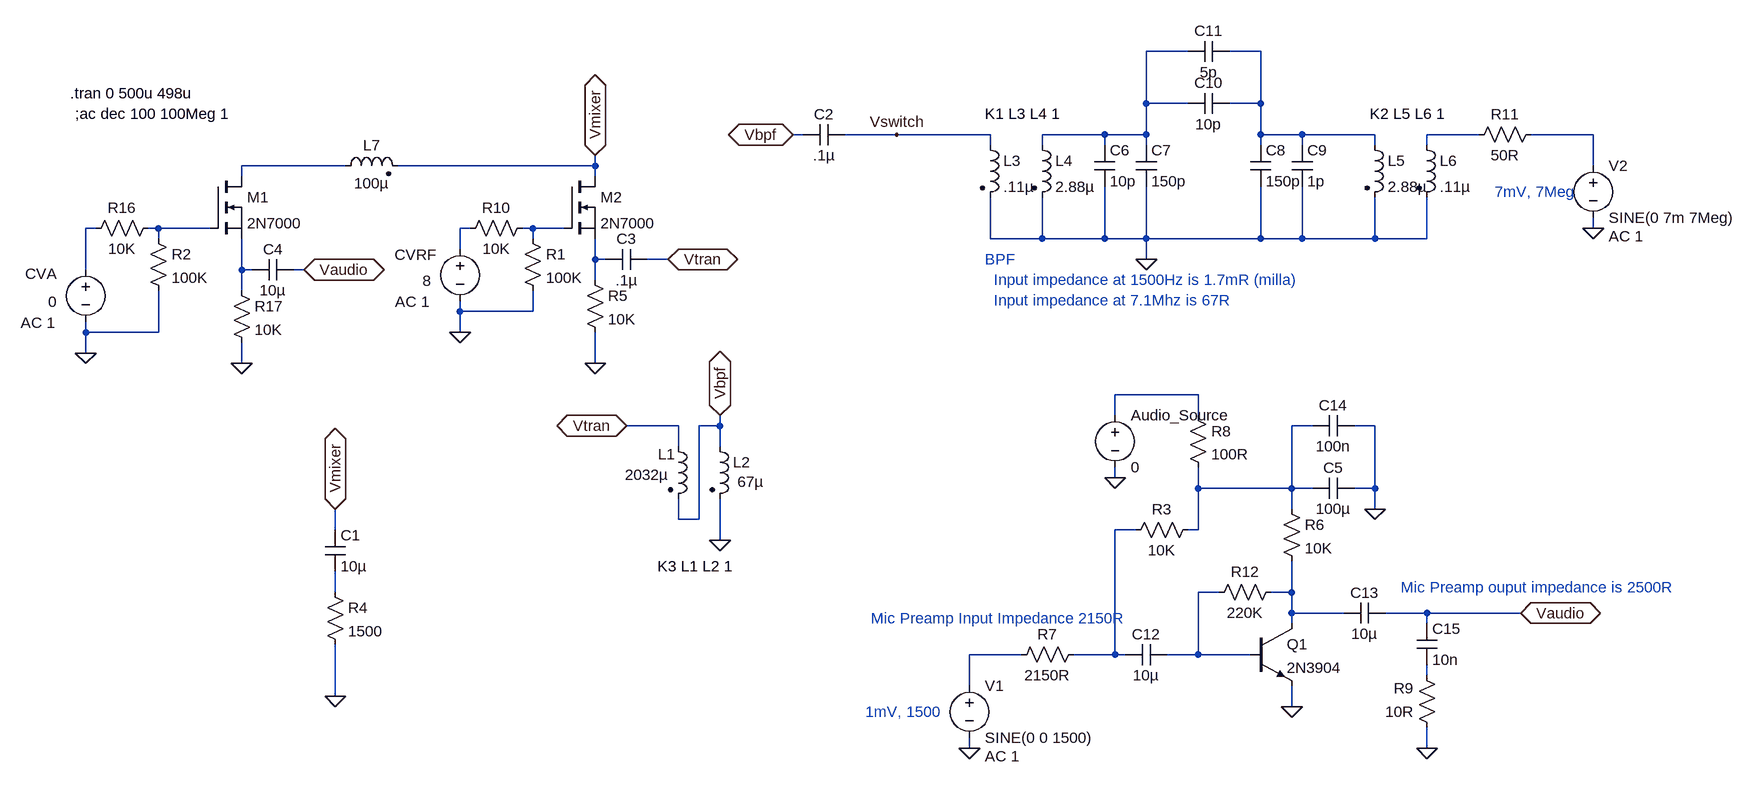
[diagram p0: schematic Receive Chain FET Switch Test.asc]
Receive Chain FET Switch Test.asc, the LTspice schematic file:
Version 4
SHEET 1 2548 2196
WIRE 816 80 752 80
WIRE 928 80 880 80
WIRE 752 160 752 80
WIRE 816 160 752 160
WIRE 928 160 928 80
WIRE 928 160 880 160
WIRE 224 208 208 208
WIRE 368 208 288 208
WIRE 512 208 368 208
WIRE 688 208 592 208
WIRE 752 208 752 160
WIRE 752 208 688 208
WIRE 928 208 928 160
WIRE 992 208 928 208
WIRE 1104 208 992 208
WIRE 1264 208 1184 208
WIRE 1440 208 1344 208
WIRE 512 224 512 208
WIRE 592 224 592 208
WIRE 688 224 688 208
WIRE 752 224 752 208
WIRE 928 224 928 208
WIRE 992 224 992 208
WIRE 1104 224 1104 208
WIRE 1184 224 1184 208
WIRE -480 256 -640 256
WIRE -96 256 -96 240
WIRE -96 256 -400 256
WIRE 1440 256 1440 208
WIRE -640 272 -640 256
WIRE -96 272 -96 256
WIRE -864 352 -880 352
WIRE -768 352 -784 352
WIRE -688 352 -768 352
WIRE -288 352 -304 352
WIRE -192 352 -208 352
WIRE -144 352 -192 352
WIRE 1440 352 1440 336
WIRE -768 368 -768 352
WIRE -192 368 -192 352
WIRE 512 368 512 304
WIRE 592 368 592 304
WIRE 592 368 512 368
WIRE 688 368 688 288
WIRE 688 368 592 368
WIRE 752 368 752 288
WIRE 752 368 688 368
WIRE 928 368 928 288
WIRE 928 368 752 368
WIRE 992 368 992 288
WIRE 992 368 928 368
WIRE 1104 368 1104 304
WIRE 1104 368 992 368
WIRE 1184 368 1184 304
WIRE 1184 368 1104 368
WIRE -304 384 -304 352
WIRE -96 400 -96 368
WIRE -80 400 -96 400
WIRE 16 400 -16 400
WIRE 752 400 752 368
WIRE -880 416 -880 352
WIRE -640 416 -640 368
WIRE -624 416 -640 416
WIRE -544 416 -560 416
WIRE -96 432 -96 400
WIRE -640 448 -640 416
WIRE -304 480 -304 464
WIRE -192 480 -192 448
WIRE -192 480 -304 480
WIRE -880 512 -880 496
WIRE -768 512 -768 448
WIRE -768 512 -880 512
WIRE -304 512 -304 480
WIRE -880 544 -880 512
WIRE -640 560 -640 528
WIRE -96 560 -96 512
WIRE 832 608 704 608
WIRE 704 640 704 608
WIRE 832 640 832 608
WIRE 32 656 -48 656
WIRE 96 656 96 640
WIRE 96 656 64 656
WIRE 1008 656 976 656
WIRE 1104 656 1072 656
WIRE 32 688 32 656
WIRE 96 688 96 656
WIRE 704 736 704 720
WIRE 832 752 832 720
WIRE 976 752 976 656
WIRE 976 752 832 752
WIRE 1008 752 976 752
WIRE 1104 752 1104 656
WIRE 1104 752 1072 752
WIRE 976 784 976 752
WIRE 1104 784 1104 752
WIRE 32 800 32 768
WIRE 64 800 64 656
WIRE 64 800 32 800
WIRE -496 816 -496 784
WIRE 736 816 704 816
WIRE 832 816 832 752
WIRE 832 816 816 816
WIRE 96 832 96 768
WIRE -496 912 -496 880
WIRE 864 912 832 912
WIRE 976 912 976 864
WIRE 976 912 944 912
WIRE 976 944 976 912
WIRE 1056 944 976 944
WIRE 1184 944 1120 944
WIRE 1328 944 1184 944
WIRE 976 960 976 944
WIRE 1184 960 1184 944
WIRE 560 1008 480 1008
WIRE 704 1008 704 816
WIRE 704 1008 640 1008
WIRE 720 1008 704 1008
WIRE 832 1008 832 912
WIRE 832 1008 784 1008
WIRE 912 1008 832 1008
WIRE 1184 1040 1184 1024
WIRE 480 1056 480 1008
WIRE -496 1072 -496 992
WIRE 976 1088 976 1056
WIRE 480 1152 480 1136
WIRE 1184 1152 1184 1120
FLAG -880 544 0
FLAG 96 640 Vbpf
IOPIN 96 640 BiDir
FLAG 752 400 0
FLAG -496 1072 0
FLAG 368 208 Vswitch
FLAG 208 208 Vbpf
IOPIN 208 208 BiDir
FLAG 1328 944 Vaudio
IOPIN 1328 944 BiDir
FLAG 96 832 0
FLAG -544 416 Vaudio
IOPIN -544 416 BiDir
FLAG -496 784 Vmixer
IOPIN -496 784 BiDir
FLAG -96 240 Vmixer
IOPIN -96 240 BiDir
FLAG -48 656 Vtran
IOPIN -48 656 BiDir
FLAG 16 400 Vtran
IOPIN 16 400 BiDir
FLAG -304 512 0
FLAG -96 560 0
FLAG -640 560 0
FLAG 704 736 0
FLAG 480 1152 0
FLAG 976 1088 0
FLAG 1104 784 0
FLAG 1184 1152 0
FLAG 1440 352 0
SYMBOL voltage -880 400 R0
WINDOW 123 -100 97 Left 2
WINDOW 39 0 0 Left 2
WINDOW 0 -93 22 Left 2
WINDOW 3 -58 65 Left 2
SYMATTR Value2 AC 1
SYMATTR InstName CVA
SYMATTR Value 0
SYMBOL cap 288 192 R90
WINDOW 0 0 32 VBottom 2
WINDOW 3 32 32 VTop 2
SYMATTR InstName C2
SYMATTR Value .1µ
SYMBOL cap 672 224 R0
SYMATTR InstName C6
SYMATTR Value 10p
SYMBOL cap 736 224 R0
SYMATTR InstName C7
SYMATTR Value 150p
SYMBOL cap 912 224 R0
SYMATTR InstName C8
SYMATTR Value 150p
SYMBOL cap 976 224 R0
SYMATTR InstName C9
SYMATTR Value 1p
SYMBOL cap 880 144 R90
WINDOW 0 0 32 VBottom 2
WINDOW 3 32 32 VTop 2
SYMATTR InstName C10
SYMATTR Value 10p
SYMBOL cap 880 64 R90
WINDOW 0 0 32 VBottom 2
WINDOW 3 32 32 VTop 2
SYMATTR InstName C11
SYMATTR Value 5p
SYMBOL ind2 496 208 R0
SYMATTR InstName L3
SYMATTR Value .11µ
SYMATTR Type ind
SYMBOL ind2 576 208 R0
SYMATTR InstName L4
SYMATTR Value 2.88µ
SYMATTR Type ind
SYMBOL ind2 1088 208 R0
SYMATTR InstName L5
SYMATTR Value 2.88µ
SYMATTR Type ind
SYMBOL ind2 1168 208 R0
SYMATTR InstName L6
SYMATTR Value .11µ
SYMATTR Type ind
SYMBOL res -512 896 R0
SYMATTR InstName R4
SYMATTR Value 1500
SYMBOL ind2 16 672 R0
WINDOW 0 -15 28 Left 2
WINDOW 3 -66 59 Left 2
SYMATTR InstName L1
SYMATTR Value 2032µ
SYMATTR Type ind
SYMBOL ind2 80 672 R0
WINDOW 3 43 70 Left 2
SYMATTR Value 67µ
SYMATTR InstName L2
SYMATTR Type ind
SYMBOL nmos -144 272 R0
SYMATTR InstName M2
SYMATTR Value 2N7000
SYMBOL res -208 352 R0
SYMATTR InstName R1
SYMATTR Value 100K
SYMBOL res -784 352 R0
SYMATTR InstName R2
SYMATTR Value 100K
SYMBOL voltage -304 368 R0
WINDOW 123 -100 97 Left 2
WINDOW 39 0 0 Left 2
WINDOW 0 -101 25 Left 2
WINDOW 3 -58 65 Left 2
SYMATTR Value2 AC 1
SYMATTR InstName CVRF
SYMATTR Value 8
SYMBOL res -192 336 R90
WINDOW 0 0 56 VBottom 2
WINDOW 3 32 56 VTop 2
SYMATTR InstName R10
SYMATTR Value 10K
SYMBOL res -768 336 R90
WINDOW 0 0 56 VBottom 2
WINDOW 3 32 56 VTop 2
SYMATTR InstName R16
SYMATTR Value 10K
SYMBOL cap -512 816 R0
SYMATTR InstName C1
SYMATTR Value 10µ
SYMBOL nmos -688 272 R0
SYMATTR InstName M1
SYMATTR Value 2N7000
SYMBOL res -112 416 R0
SYMATTR InstName R5
SYMATTR Value 10K
SYMBOL res -656 432 R0
SYMATTR InstName R17
SYMATTR Value 10K
SYMBOL cap -16 384 R90
WINDOW 0 0 32 VBottom 2
WINDOW 3 32 32 VTop 2
SYMATTR InstName C3
SYMATTR Value .1µ
SYMBOL cap -560 400 R90
WINDOW 0 0 32 VBottom 2
WINDOW 3 32 32 VTop 2
SYMATTR InstName C4
SYMATTR Value 10µ
SYMBOL ind2 -496 272 R270
WINDOW 0 32 56 VTop 2
WINDOW 3 5 56 VBottom 2
SYMATTR InstName L7
SYMATTR Value 100µ
SYMATTR Type ind
SYMBOL npn 912 960 R0
SYMATTR InstName Q1
SYMATTR Value 2N3904
SYMBOL res 832 800 R90
WINDOW 0 0 56 VBottom 2
WINDOW 3 32 56 VTop 2
SYMATTR InstName R3
SYMATTR Value 10K
SYMBOL res 960 768 R0
SYMATTR InstName R6
SYMATTR Value 10K
SYMBOL cap 1072 736 R90
WINDOW 0 0 32 VBottom 2
WINDOW 3 32 32 VTop 2
SYMATTR InstName C5
SYMATTR Value 100µ
SYMBOL cap 784 992 R90
WINDOW 0 0 32 VBottom 2
WINDOW 3 32 32 VTop 2
SYMATTR InstName C12
SYMATTR Value 10µ
SYMBOL voltage 480 1040 R0
WINDOW 123 24 124 Left 2
WINDOW 39 0 0 Left 2
SYMATTR Value2 AC 1
SYMATTR InstName V1
SYMATTR Value SINE(0 0 1500)
SYMBOL voltage 704 624 R0
WINDOW 123 0 0 Left 2
WINDOW 39 0 0 Left 2
SYMATTR InstName Audio_Source
SYMATTR Value 0
SYMBOL res 656 992 R90
WINDOW 0 0 56 VBottom 2
WINDOW 3 32 56 VTop 2
SYMATTR InstName R7
SYMATTR Value 2150R
SYMBOL res 816 624 R0
SYMATTR InstName R8
SYMATTR Value 100R
SYMBOL cap 1120 928 R90
WINDOW 0 0 32 VBottom 2
WINDOW 3 32 32 VTop 2
SYMATTR InstName C13
SYMATTR Value 10µ
SYMBOL res 1200 1136 R180
WINDOW 0 36 76 Left 2
WINDOW 3 36 40 Left 2
SYMATTR InstName R9
SYMATTR Value 10R
SYMBOL cap 1072 640 R90
WINDOW 0 0 32 VBottom 2
WINDOW 3 32 32 VTop 2
SYMATTR InstName C14
SYMATTR Value 100n
SYMBOL res 960 896 R90
WINDOW 0 0 56 VBottom 2
WINDOW 3 32 56 VTop 2
SYMATTR InstName R12
SYMATTR Value 220K
SYMBOL cap 1168 960 R0
SYMATTR InstName C15
SYMATTR Value 10n
SYMBOL voltage 1440 240 R0
WINDOW 123 24 124 Left 2
WINDOW 39 0 0 Left 2
SYMATTR Value2 AC 1
SYMATTR InstName V2
SYMATTR Value SINE(0 7m 7Meg)
SYMBOL res 1248 224 R270
WINDOW 0 32 56 VTop 2
WINDOW 3 0 56 VBottom 2
SYMATTR InstName R11
SYMATTR Value 50R
TEXT -904 144 Left 2 !.tran 0 500u 498u
TEXT -896 176 Left 2 !;ac dec 100 100Meg 1
TEXT 504 176 Left 2 !K1 L3 L4 1
TEXT 1096 176 Left 2 !K2 L5 L6 1
TEXT 504 400 Left 2 ;BPF\n  Input impedance at 1500Hz is 1.7mR (milla)\n  Input impedance at 7.1Mhz is 67R
TEXT 0 872 Left 2 !K3 L1 L2 1
TEXT 328 952 Left 2 ;Mic Preamp Input Impedance 2150R
TEXT 1144 904 Left 2 ;Mic Preamp ouput impedance is 2500R
TEXT 1288 296 Left 2 ;7mV, 7Meg
TEXT 320 1096 Left 2 ;1mV, 1500

The netlist it stands for:
* Receive Chain FET Switch Test.asc
V§CVA N006 0 0 AC 1
C2 Vswitch Vbpf .1µ
C6 N001 0 10p
C7 N001 0 150p
C8 N002 0 150p
C9 N002 0 1p
C10 N002 N001 10p
C11 N002 N001 5p
L3 Vswitch 0 .11µ
L4 N001 0 2.88µ
L5 N002 0 2.88µ
L6 N003 0 .11µ
R4 N015 0 1500
L1 Vtran Vbpf 2032µ
L2 Vbpf 0 67µ
M2 Vmixer N009 N010 N010 2N7000
R1 N009 0 100K
R2 N007 0 100K
V§CVRF N008 0 8 AC 1
R10 N009 N008 10K
R16 N007 N006 10K
C1 Vmixer N015 10µ
M1 N005 N007 N011 N011 2N7000
R5 N010 0 10K
R17 N011 0 10K
C3 Vtran N010 .1µ
C4 Vaudio N011 10µ
L7 N005 Vmixer 100µ
Q1 N017 N016 0 0 2N3904
R3 N013 N014 10K
R6 N013 N017 10K
C5 0 N013 100µ
C12 N016 N014 10µ
V1 N018 0 SINE(0 0 1500) AC 1
V§Audio_Source N012 0 0
R7 N014 N018 2150R
R8 N012 N013 100R
C13 Vaudio N017 10µ
R9 0 N019 10R
C14 0 N013 100n
R12 N017 N016 220K
C15 Vaudio N019 10n
V2 N004 0 SINE(0 7m 7Meg) AC 1
R11 N003 N004 50R
.model NPN NPN
.model PNP PNP
.lib standard.bjt
.model NMOS NMOS
.model PMOS PMOS
.lib standard.mos
.tran 0 500u 498u
;ac dec 100 100Meg 1
K1 L3 L4 1
K2 L5 L6 1
* BPF
*   Input impedance at 1500Hz is 1.7mR (milla)
*   Input impedance at 7.1Mhz is 67R
K3 L1 L2 1
* Mic Preamp Input Impedance 2150R
* Mic Preamp ouput impedance is 2500R
* 7mV, 7Meg
* 1mV, 1500
.backanno
.end